# EAGLE design 20230108_SwitchpHAT_rev2 (EAGLE 9.6.2)
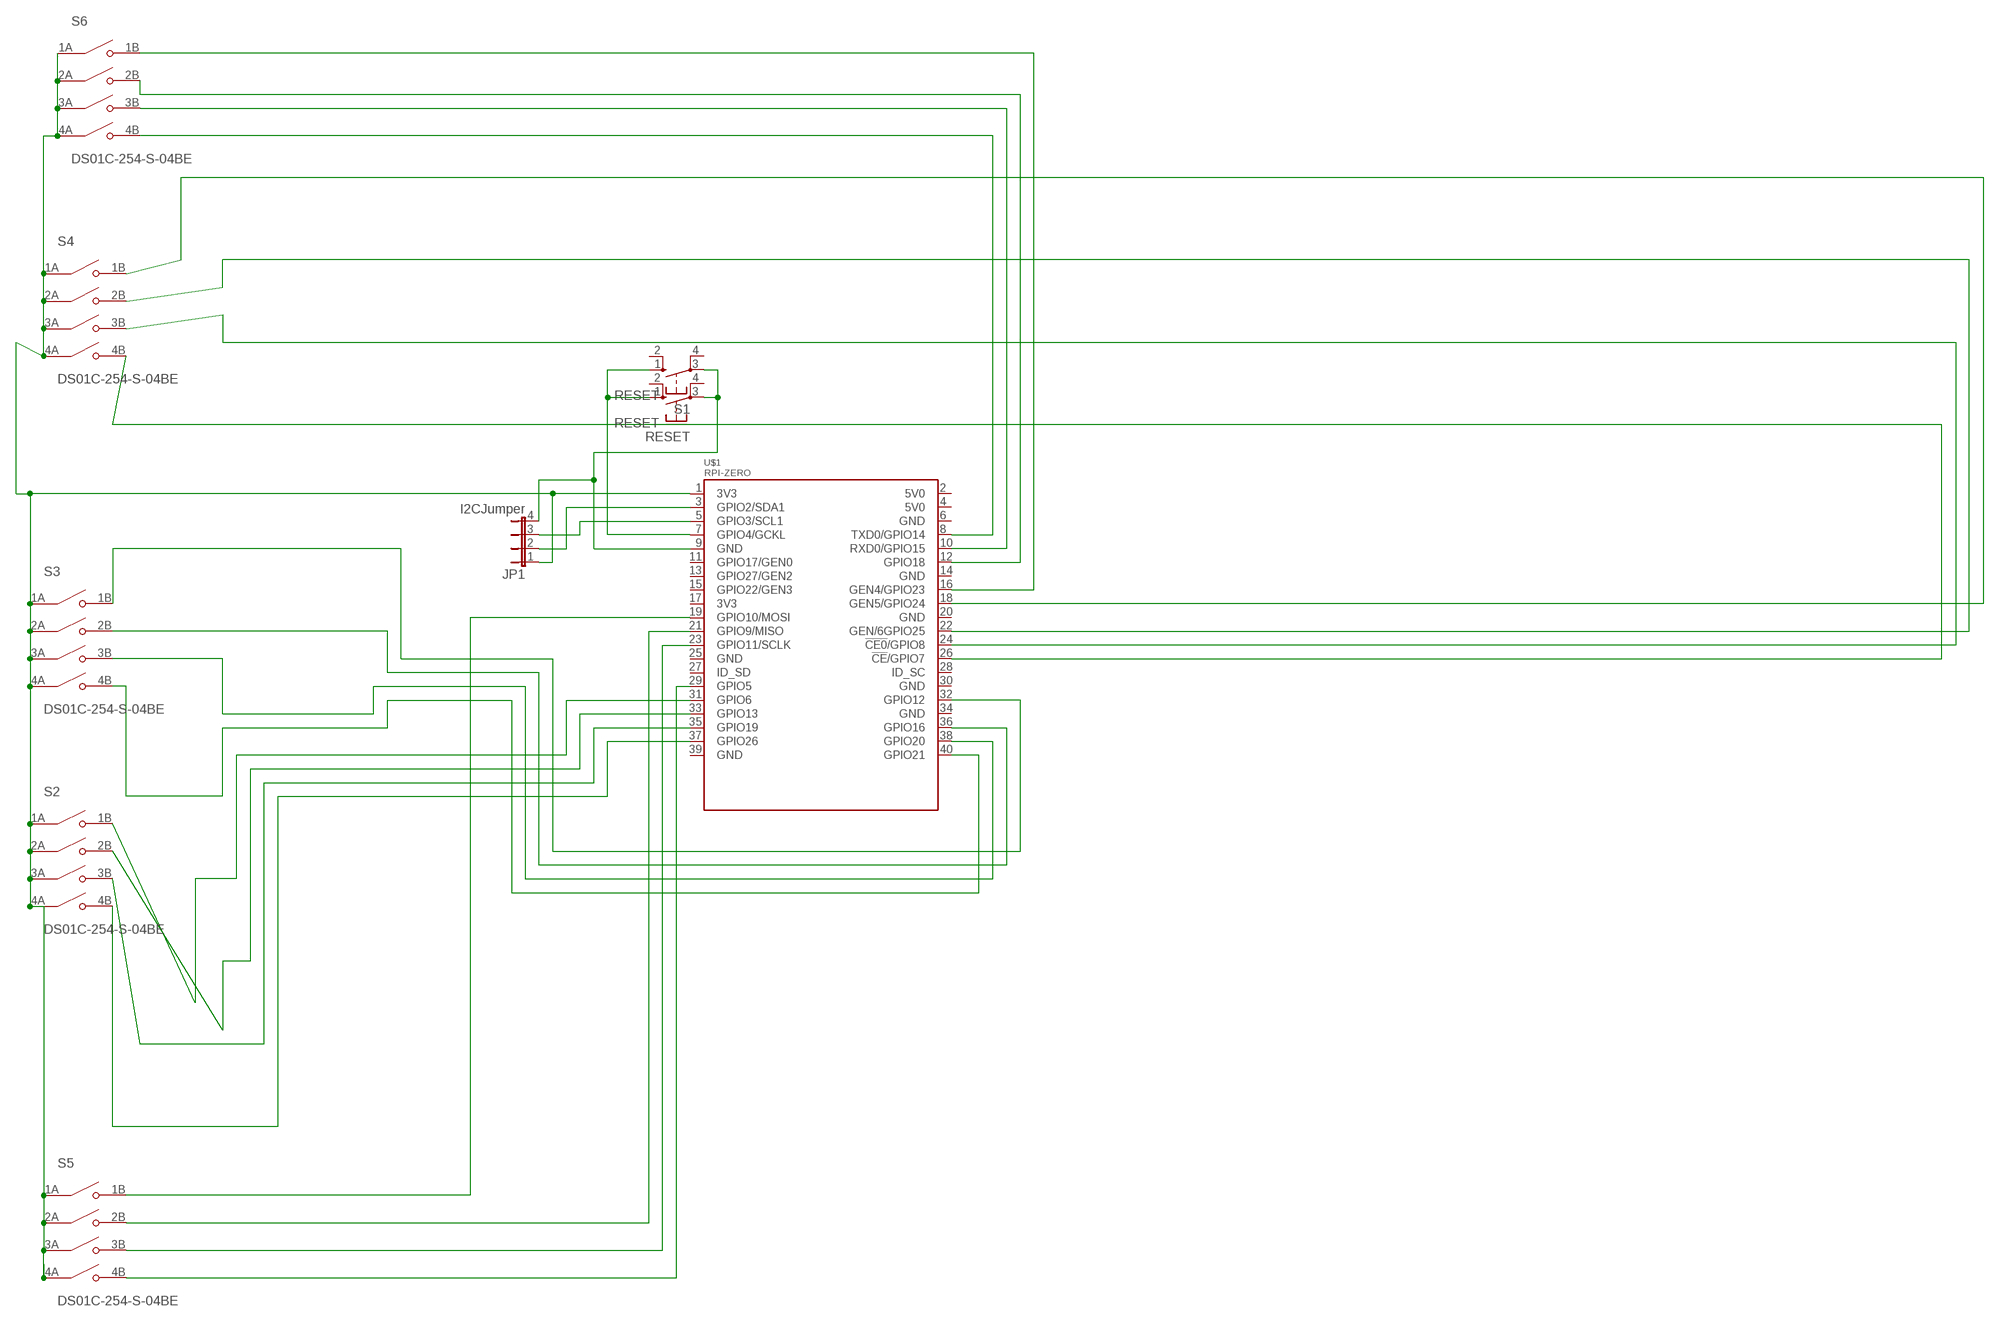
[diagram p0: schematic, sheet 1]

## Parts
JP1  I2CJumper  JP4E  [JP4]
RESET  RESET  40-XX  [B3F-40XX]
S1  RESET  10-XX  [B3F-10XX]
S2  DS01C-254-S-04BE  [SW_DS01C-254-S-04BE]
S3  DS01C-254-S-04BE  [SW_DS01C-254-S-04BE]
S4  DS01C-254-S-04BE  [SW_DS01C-254-S-04BE]
S5  DS01C-254-S-04BE  [SW_DS01C-254-S-04BE]
S6  DS01C-254-S-04BE  [SW_DS01C-254-S-04BE]
U$1  RPI-ZERO  [RASPBERRYPI_BASTELSTUBE_V13_RASPI_BOARD_B+_FULL]

## Nets
3V3: JP1.1 S2.1A(COM1) S2.2A(COM2) S2.3A(COM3) S2.4A(COM4) S3.1A(COM1) S3.2A(COM2) S3.3A(COM3) S3.4A(COM4) S4.1A(COM1) S4.2A(COM2) S4.3A(COM3) S4.4A(COM4) S5.1A(COM1) S5.2A(COM2) S5.3A(COM3) S5.4A(COM4) S6.1A(COM1) S6.2A(COM2) S6.3A(COM3) S6.4A(COM4) U$1.1(3V3)
GND: JP1.4 RESET.3(P) S1.3(P) U$1.9(GND)
N$1: S3.1B(NO1) U$1.32(GPIO12)
N$2: S2.4B(NO4) U$1.37(GPIO26)
N$3: S2.3B(NO3) U$1.35(GPIO19)
N$4: S2.2B(NO2) U$1.33(GPIO13)
N$5: S2.1B(NO1) U$1.31(GPIO6)
N$6: S4.4B(NO4) U$1.26(!CE!/GPIO7)
N$7: S4.3B(NO3) U$1.24(!CE0!/GPIO8)
N$8: S3.2B(NO2) U$1.36(GPIO16)
N$9: S3.3B(NO3) U$1.38(GPIO20)
N$10: S3.4B(NO4) U$1.40(GPIO21)
N$11: RESET.1(S) S1.1(S) U$1.7(GPIO4/GCKL)
N$12: S4.2B(NO2) U$1.22(GEN/6GPIO25)
N$13: S4.1B(NO1) U$1.18(GEN5/GPIO24)
N$15: S5.4B(NO4) U$1.29(GPIO5)
N$16: S5.3B(NO3) U$1.23(GPIO11/SCLK)
N$17: S5.2B(NO2) U$1.21(GPIO9/MISO)
N$18: S5.1B(NO1) U$1.19(GPIO10/MOSI)
N$19: S6.4B(NO4) U$1.8(TXD0/GPIO14)
N$20: JP1.2 U$1.3(GPIO2/SDA1)
N$21: S6.3B(NO3) U$1.10(RXD0/GPIO15)
N$22: S6.2B(NO2) U$1.12(GPIO18)
N$23: S6.1B(NO1) U$1.16(GEN4/GPIO23)
N$24: JP1.3 U$1.5(GPIO3/SCL1)
Unconnected: RESET.2(S1) RESET.4(P1) S1.2(S1) S1.4(P1) U$1.2(5V0) U$1.4(5V0) U$1.6(GND) U$1.11(GPIO17/GEN0) U$1.13(GPIO27/GEN2) U$1.14(GND) U$1.15(GPIO22/GEN3) U$1.17(3V3) U$1.20(GND) U$1.25(GND) U$1.27(ID_SD) U$1.28(ID_SC) U$1.30(GND) U$1.34(GND) U$1.39(GND)

## Library data of the parts
JP1 = jumper_I2C:JP4E: JUMPER
RESET = switch-omron_NoSilk2:40-XX: OMRON SWITCH; MF: OMRON ELECTRONIC COMPONENTS; MPN: B3F-4000; OC_FARNELL: 176434; OC_NEWARK: 36K3105
S1 = switch-omron_NoSilk2:10-XX: OMRON SWITCH; OC_FARNELL: 176432; OC_NEWARK: unknown
S2 = DS01C-254-S-04BE:DS01C-254-S-04BE; CUI_PURCHASE_URL: https://www.cuidevices.com/product/switches/dip-switches/ds01-254-series?utm_source=snapeda.com&utm_medium=referral&utm_campaign=snapedaBOM; DESCRIPTION: 4 Position, Through Hole, 2.54 mm Pitch, Raised Slide Actuator, Convex Bottom, Short Pin, DIP Switch; DIGI-KEY_PART_NUMBER: 2223-DS01C-254-S-04BE-ND; MF: CUI Devices; MP: DS01C-254-S-04BE; OC_NEWARK: unknown; PACKAGE: None; PURCHASE-URL: https://pricing.snapeda.com/search/part/DS01C-254-S-04BE/?ref=eda
S3-S6 = DS01C-254-S-04BE:DS01C-254-S-04BE; CUI_PURCHASE_URL: https://www.cuidevices.com/product/switches/dip-switches/ds01-254-series?utm_source=snapeda.com&utm_medium=referral&utm_campaign=snapedaBOM; DESCRIPTION: 4 Position, Through Hole, 2.54 mm Pitch, Raised Slide Actuator, Convex Bottom, Short Pin, DIP Switch; DIGI-KEY_PART_NUMBER: 2223-DS01C-254-S-04BE-ND; MF: CUI Devices; MP: DS01C-254-S-04BE; PACKAGE: None; PURCHASE-URL: https://pricing.snapeda.com/search/part/DS01C-254-S-04BE/?ref=eda
U$1 = RPI-Zero_Bonnet:RPI-ZERO

## Board
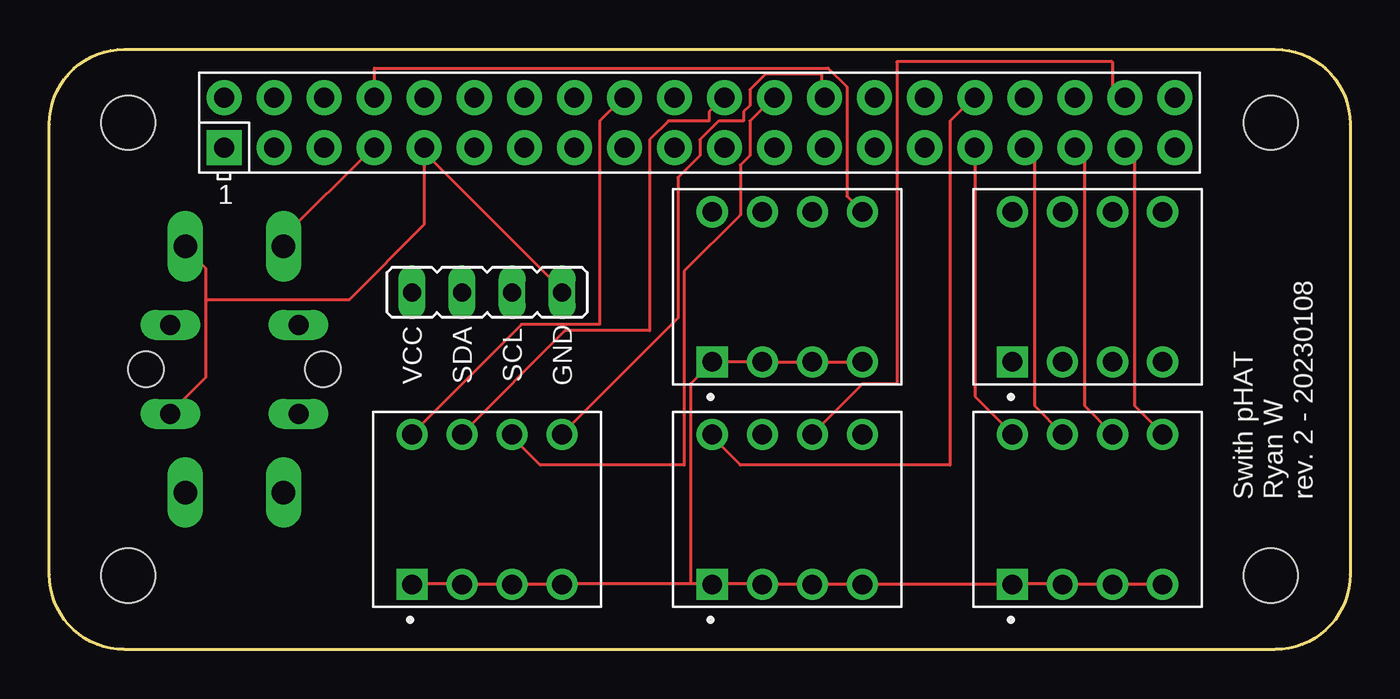
[diagram p1: board, top side]
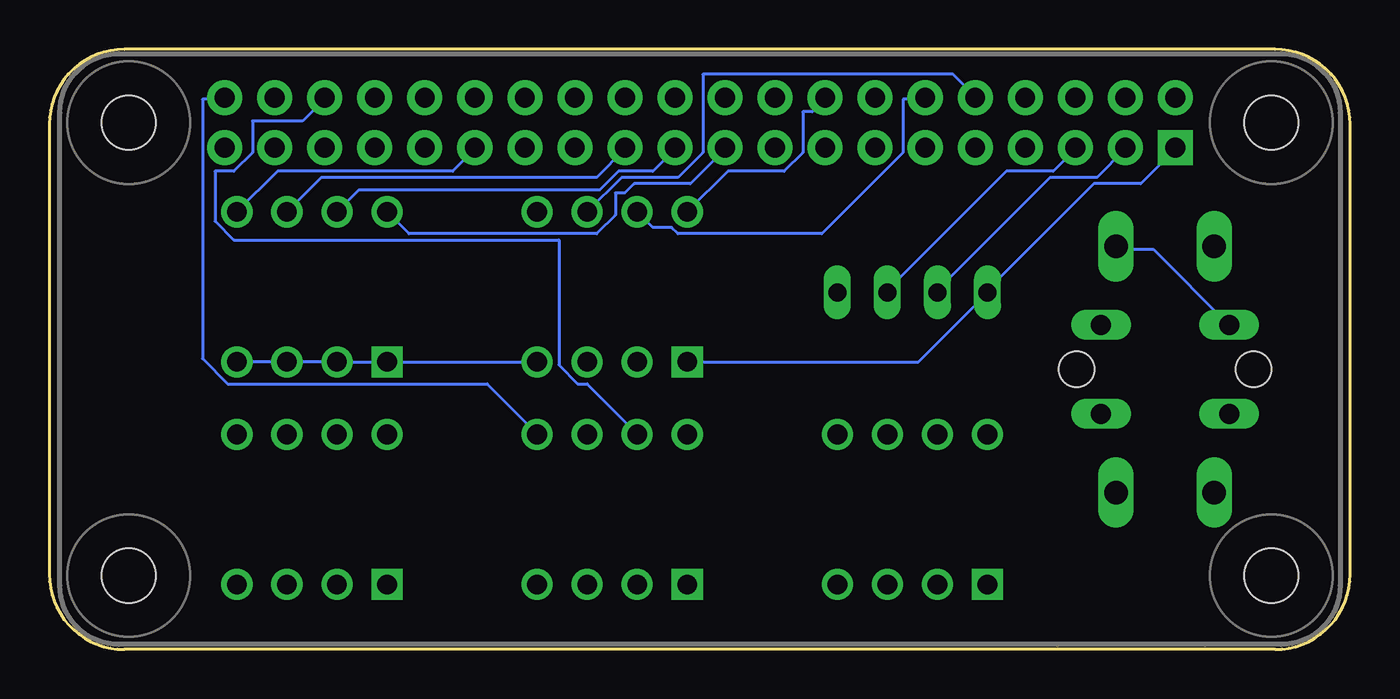
[diagram p2: board, bottom side, seen from below]

Size 66.04 x 30.48 mm. Coordinates in mm from the lower left corner, seen from the top.
Outline: 0,3.81 0,26.67 arc-90 3.81,30.48 62.23,30.48 arc-90 66.04,26.67 66.04,3.81 arc-90 62.23,0 3.81,0 arc-90 0,3.81
Copper layers (1*16): Top 0.035559375mm / dielectric 1.6mm / Bottom 0.035559375mm
Design rules "oshpark-2layer": minimum track width 6mil, minimum drill 10mil, track to track 6mil, track to pad 6mil, pad to pad 6mil, via to via 6mil, smd to smd 6mil, copper to edge 15mil, drill to drill 6mil, minimum pad ring 5mil, minimum via ring 5mil, stop-mask expansion 2.5mil, vias tented up to drill 0mil, thermal gap 10mil

### Footprints (pad centres in the part's own frame; a part is rotated, then mirrored left to right if it is on the bottom)
JP4 = drill 0.914 long: 1 -3.81,0; 2 -1.27,0; 3 1.27,0; 4 3.81,0
B3F-40XX = drill 1.194 long: 1 -6.248,2.489; 2 6.248,2.489; 3 -6.248,-2.489; 4 6.248,-2.489 | hole 1.803: 0,-4.496; 0,4.496
B3F-10XX = drill 1.016 long: 1 -3.251,2.261; 2 3.251,2.261; 3 -3.251,-2.261; 4 3.251,-2.261
SW_DS01C-254-S-04BE = drill 1 pad 1.58 square: 1A -3.81,-3.81 | drill 1 pad 1.58: 1B -3.81,3.81; 2A -1.27,-3.81; 2B -1.27,3.81; 3A 1.27,-3.81; 3B 1.27,3.81; 4A 3.81,-3.81; 4B 3.81,3.81
RASPBERRYPI_BASTELSTUBE_V13_RASPI_BOARD_B+_FULL = drill 1 pad 1.778 square: 1 8.37,25.23 | drill 1 pad 1.778: 2 8.37,27.77; 3 10.91,25.23; 4 10.91,27.77; 5 13.45,25.23; 6 13.45,27.77; 7 15.99,25.23; 8 15.99,27.77; 9 18.53,25.23; 10 18.53,27.77; 11 21.07,25.23; 12 21.07,27.77; 13 23.61,25.23; 14 23.61,27.77; 15 26.15,25.23; 16 26.15,27.77; 17 28.69,25.23; 18 28.69,27.77; 19 31.23,25.23; 20 31.23,27.77; 21 33.77,25.23; 22 33.77,27.77; 23 36.31,25.23; 24 36.31,27.77; 25 38.85,25.23; 26 38.85,27.77; 27 41.39,25.23; 28 41.39,27.77; 29 43.93,25.23; 30 43.93,27.77; 31 46.47,25.23; 32 46.47,27.77; 33 49.01,25.23; 34 49.01,27.77; 35 51.55,25.23; 36 51.55,27.77; 37 54.09,25.23; 38 54.09,27.77; 39 56.63,25.23; 40 56.63,27.77 | hole 2.75: 3.5,3.5; 3.5,26.5; 61.5,3.5; 61.5,26.5

### Placement (x,y rotation side)
JP1  22.23,18.13 0 top
RESET  9.4,14.22 270 top
S1  9.4,14.22 0 top
S2  52.7,7.11 0 top
S3  37.47,7.11 0 top
S4  22.23,7.11 0 top
S5  52.7,18.41 0 top
S6  37.47,18.41 0 top
U$1  0.51,0.25 0 top

### Tracks (layer width: path | path; a pad name or v marks a point on that pad's centre or on a via)
3V3
  Top 0.152: 51.44,3.33 48.9,3.33 | 51.44,3.33 53.98,3.33 | 51.44,3.33 S2.2A | 53.98,3.33 56.52,3.33 S2.4A | 53.98,3.33 S2.3A | 20.95,3.33 18.41,3.33 S4.1A | 20.95,3.33 23.5,3.33 | 20.95,3.33 S4.2A | 23.5,3.33 26.04,3.33 | 23.5,3.33 S4.3A | 36.2,3.33 33.66,3.33 | 36.2,3.33 38.73,3.33 | 36.2,3.33 S3.2A | 38.73,3.33 41.27,3.33 | 38.73,3.33 S3.3A | 33.66,3.33 32.54,3.33 | 32.54,3.33 26.04,3.33 | 26.04,3.33 S4.4A | 33.66,3.33 S3.1A | 41.27,3.33 48.9,3.33 | 48.9,3.33 S2.1A | 41.27,3.33 S3.4A | S6.4A S6.3A S6.2A S6.1A 32.54,13.49 32.54,3.33
  Bottom 0.152: U$1.1 8.89,25.4 10.64,23.65 13.02,23.65 18.41,18.26 JP1.1 18.41,18.1 21.91,14.61 S6.1A | S5.4A S5.3A S5.2A S5.1A S6.4A
GND
  Top 0.152: 7.94,17.78 7.94,19.37 6.99,20.32 RESET.3 | 7.94,17.78 7.94,13.81 6.19,12.06 S1.3 | 19.05,25.24 26.04,18.26 JP1.4 | 19.05,25.24 19.05,25.4 U$1.9 | 7.94,17.78 15.24,17.78 19.05,21.59 19.05,25.24
N$1
  Top 0.152: S3.1B 33.66,10.79 35.08,9.37 45.72,9.37 45.72,26.83 46.83,27.94 U$1.32
N$2
  Top 0.152: S2.4B 56.52,10.95 55.09,12.38 55.09,24.92 54.61,25.4 U$1.37
N$3
  Top 0.152: S2.3B 53.98,10.95 52.55,12.38 52.55,24.92 52.07,25.4 U$1.35
N$4
  Top 0.152: S2.2B 51.44,10.95 50.01,12.38 50.01,24.92 49.53,25.4 U$1.33
N$5
  Top 0.152: S2.1B 48.9,10.95 46.99,12.86 46.99,25.4 U$1.31
N$6
  Top 0.152: S4.4B 26.04,10.95 31.91,16.83 31.91,23.97 33.02,25.08 33.02,25.88 33.97,26.83 35.24,26.83 35.24,27.3 35.56,27.62 35.56,28.42 36.35,29.21 39.21,29.21 39.21,28.1 U$1.26
N$7
  Top 0.152: S4.3B 23.5,10.79 24.92,9.37 32.23,9.37 32.23,19.21 35.08,22.07 35.08,24.61 35.56,25.08 35.56,26.83 36.67,27.94 U$1.24
N$8
  Bottom 0.152: S3.2B 36.2,10.95 38.73,13.49 39.21,13.49 40.16,14.45 40.16,20.8 56.67,20.8 57.63,21.75 57.63,24.29 56.67,24.29 55.72,25.24 55.72,26.83 53.18,26.83 52.07,27.94 U$1.36
N$9
  Top 0.152: S3.3B 38.73,10.95 41.27,13.49 43.02,13.49 43.02,29.84 53.98,29.84 53.98,28.57 54.45,28.1 U$1.38
N$10
  Bottom 0.152: S3.4B 41.27,10.95 43.81,13.49 56.99,13.49 58.26,14.76 58.26,27.94 57.15,27.94 U$1.40
N$11
  Top 0.152: U$1.7 16.35,25.4 11.91,20.95 11.91,20.48 RESET.1
  Bottom 0.152: S1.1 6.19,16.51 10,20.32 11.75,20.32 RESET.1
N$12
  Top 0.152: S4.2B 20.95,10.95 26.19,16.19 30.48,16.19 30.48,25.88 31.43,26.83 33.5,26.83 33.5,27.3 34.13,27.94 U$1.22
N$13
  Top 0.152: S4.1B 18.41,10.95 23.97,16.51 27.94,16.51 27.94,26.83 29.05,27.94 U$1.18
N$15
  Bottom 0.152: S5.4B 54.45,24.29 45.56,24.29 44.45,25.4 U$1.29
N$16
  Bottom 0.152: S5.3B 52.23,23.97 38.26,23.97 36.83,25.4 U$1.23
N$17
  Bottom 0.152: S5.2B 50.32,23.34 38.1,23.34 37.15,24.29 35.4,24.29 34.29,25.4 U$1.21
N$18
  Bottom 0.152: S5.1B 47.78,21.11 38.26,21.11 37.31,22.07 37.31,23.18 36.83,23.18 36.35,23.65 33.5,23.65 31.75,25.4 U$1.19
N$19
  Top 0.152: S6.4B 40.48,23.02 40.48,28.57 39.53,29.53 16.51,29.53 16.51,28.1 U$1.8
N$20
  Bottom 0.152: JP1.2 20.95,18.26 15.24,23.97 12.86,23.97 11.43,25.4 U$1.3
N$21
  Bottom 0.152: S6.3B 36.99,23.97 34.13,23.97 32.86,25.24 32.86,29.21 20.16,29.21 19.05,28.1 U$1.10
N$22
  Bottom 0.152: S6.2B 35.4,21.43 34.45,21.43 34.13,21.11 26.83,21.11 22.7,25.24 22.7,27.94 21.59,27.94 U$1.12
N$23
  Bottom 0.152: S6.1B 31.59,24.29 28.73,24.29 27.78,25.24 27.78,27.3 27.3,27.3 26.67,27.94 U$1.16
N$24
  Bottom 0.152: JP1.3 23.5,18.26 17.46,24.29 15.08,24.29 13.97,25.4 U$1.5

### Text on the board
tNames: Swith pHAT / Ryan W / rev. 2 - 20230108